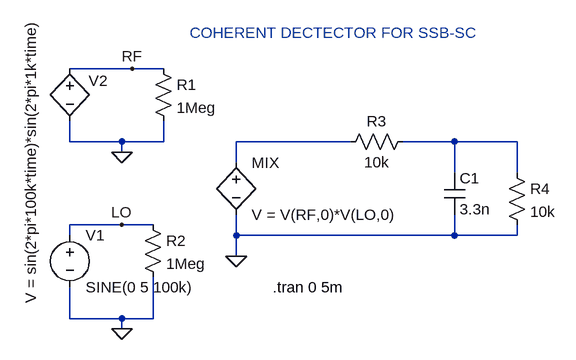
[diagram p0: schematic Coherent detector.asc]
Coherent detector.asc, the LTspice schematic file:
Version 4.1
SHEET 1 1444 724
WIRE 192 80 96 80
WIRE 240 80 192 80
WIRE 96 192 96 160
WIRE 176 192 96 192
WIRE 240 192 240 160
WIRE 240 192 176 192
WIRE 528 192 352 192
WIRE 688 192 608 192
WIRE 784 192 688 192
WIRE 176 208 176 192
WIRE 352 224 352 192
WIRE 688 240 688 192
WIRE 784 240 784 192
WIRE 176 320 96 320
WIRE 224 320 176 320
WIRE 96 336 96 320
WIRE 352 336 352 304
WIRE 688 336 688 304
WIRE 688 336 352 336
WIRE 784 336 784 320
WIRE 784 336 688 336
WIRE 352 368 352 336
WIRE 96 464 96 416
WIRE 176 464 96 464
WIRE 224 464 224 400
WIRE 224 464 176 464
WIRE 176 480 176 464
FLAG 176 208 0
FLAG 176 480 0
FLAG 352 368 0
FLAG 192 80 RF
FLAG 176 320 LO
SYMBOL bv 96 64 R0
WINDOW 0 29 34 Left 2
WINDOW 3 -60 -58 VRight 2
SYMATTR InstName V2
SYMATTR Value V = sin(2*pi*100k*time)*sin(2*pi*1k*time)
SYMBOL bv 352 208 R0
SYMATTR InstName MIX
SYMATTR Value V = V(RF,0)*V(LO,0)
SYMBOL voltage 96 320 R0
SYMATTR InstName V1
SYMATTR Value SINE(0 5 100k)
SYMBOL res 224 64 R0
SYMATTR InstName R1
SYMATTR Value 1Meg
SYMBOL res 208 304 R0
SYMATTR InstName R2
SYMATTR Value 1Meg
SYMBOL res 624 176 R90
WINDOW 0 0 56 VBottom 2
WINDOW 3 32 56 VTop 2
SYMATTR InstName R3
SYMATTR Value 10k
SYMBOL cap 672 240 R0
SYMATTR InstName C1
SYMATTR Value 3.3n
SYMBOL res 768 224 R0
SYMATTR InstName R4
SYMATTR Value 10k
TEXT 408 416 Left 2 !.tran 0 5m
TEXT 280 24 Left 2 ;COHERENT DECTECTOR FOR SSB-SC

The netlist it stands for:
* Coherent detector.asc
B§V2 RF 0 V = sin(2*pi*100k*time)*sin(2*pi*1k*time)
B§MIX N001 0 V = V(RF,0)*V(LO,0)
V1 LO 0 SINE(0 5 100k)
R1 RF 0 1Meg
R2 LO 0 1Meg
R3 N002 N001 10k
C1 N002 0 3.3n
R4 N002 0 10k
.tran 0 5m
* COHERENT DECTECTOR FOR SSB-SC
.backanno
.end